# EAGLE design CompactDomeSensorRing (EAGLE 9.7.0)
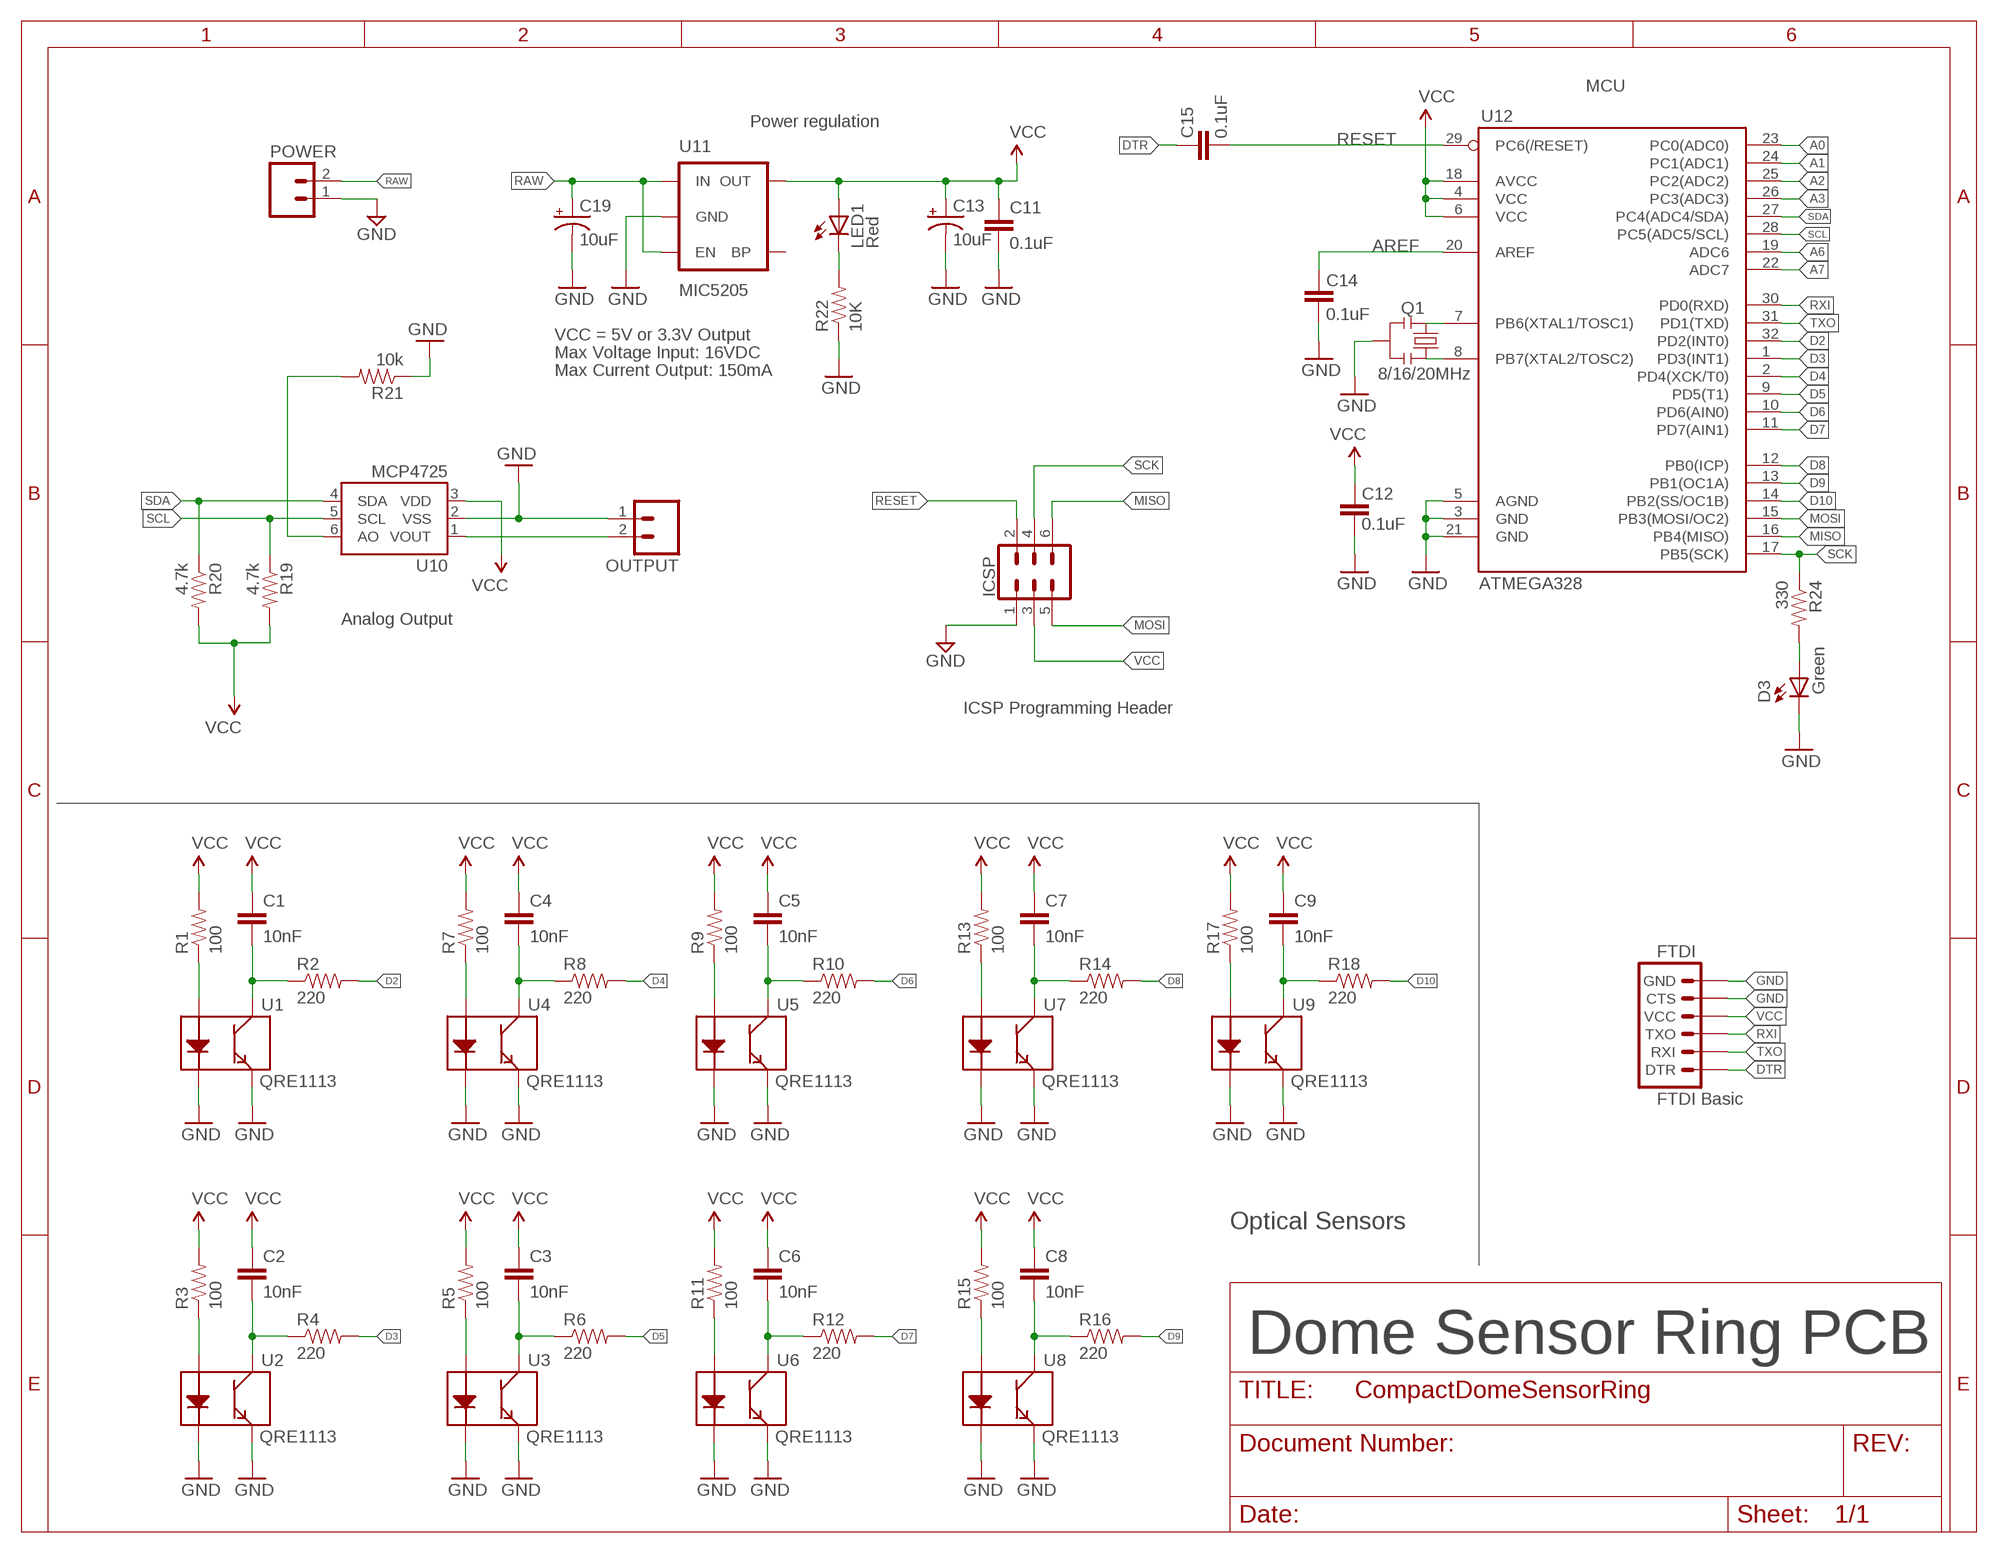
[diagram p0: schematic, sheet 1]

## Parts
C1  10nF  CAP0402-CAP  [0402-CAP]
C2  10nF  CAP0402-CAP  [0402-CAP]
C3  10nF  CAP0402-CAP  [0402-CAP]
C4  10nF  CAP0402-CAP  [0402-CAP]
C5  10nF  CAP0402-CAP  [0402-CAP]
C6  10nF  CAP0402-CAP  [0402-CAP]
C7  10nF  CAP0402-CAP  [0402-CAP]
C8  10nF  CAP0402-CAP  [0402-CAP]
C9  10nF  CAP0402-CAP  [0402-CAP]
C11  0.1uF  CAP0603-CAP  [0603-CAP]
C12  0.1uF  CAP0603-CAP  [0603-CAP]
C13  10uF  CAP_POL1206  [EIA3216]
C14  0.1uF  CAP0603-CAP  [0603-CAP]
C15  0.1uF  CAP0603-CAP  [0603-CAP]
C19  10uF  CAP_POL1206  [EIA3216]
D3  Green  LED  [0603-LED-ALT1]
FTDI  FTDI Basic  ARDUINO_SERIAL_PROGRAMPTH  [1X06]
ICSP  CONN_03X2NO_SILK  [2X3-NS]
LED1  Red  LED  [0603-LED-ALT1]
OUTPUT  M02PTH  [1X02]
POWER  M02PTH  [1X02]
Q1  8/16/20MHz  RESONATOR1:1  [RESONATOR-SMD-1:1]
R1  100  RESISTOR0402-RES  [0402-RES]
R2  220  RESISTOR0402-RES  [0402-RES]
R3  100  RESISTOR0402-RES  [0402-RES]
R4  220  RESISTOR0402-RES  [0402-RES]
R5  100  RESISTOR0402-RES  [0402-RES]
R6  220  RESISTOR0402-RES  [0402-RES]
R7  100  RESISTOR0402-RES  [0402-RES]
R8  220  RESISTOR0402-RES  [0402-RES]
R9  100  RESISTOR0402-RES  [0402-RES]
R10  220  RESISTOR0402-RES  [0402-RES]
R11  100  RESISTOR0402-RES  [0402-RES]
R12  220  RESISTOR0402-RES  [0402-RES]
R13  100  RESISTOR0402-RES  [0402-RES]
R14  220  RESISTOR0402-RES  [0402-RES]
R15  100  RESISTOR0402-RES  [0402-RES]
R16  220  RESISTOR0402-RES  [0402-RES]
R17  100  RESISTOR0402-RES  [0402-RES]
R18  220  RESISTOR0402-RES  [0402-RES]
R19  4.7k  RESISTOR0603-RES  [0603-RES]
R20  4.7k  RESISTOR0603-RES  [0603-RES]
R21  10k  RESISTOR0603-RES  [0603-RES]
R22  10K  RESISTOR0603-RES  [0603-RES]
R24  330  RESISTOR0603-RES  [0603-RES]
U1  QRE1113  [QRE1113]
U2  QRE1113  [QRE1113]
U3  QRE1113  [QRE1113]
U4  QRE1113  [QRE1113]
U5  QRE1113  [QRE1113]
U6  QRE1113  [QRE1113]
U7  QRE1113  [QRE1113]
U8  QRE1113  [QRE1113]
U9  QRE1113  [QRE1113]
U10  MCP4725  MCP4725SOT-23  [SOT23-6]
U11  MIC5205  V_REG_LDOSMD  [SOT23-5]
U12  ATMEGA328  ATMEGA168  [TQFP32-08]

## Nets
A0: U12.23(PC0(ADC0))
A1: U12.24(PC1(ADC1))
A2: U12.25(PC2(ADC2))
A3: U12.26(PC3(ADC3))
A6: U12.19(ADC6)
A7: U12.22(ADC7)
AREF: C14.2 U12.20(AREF)
D2: R2.2 U12.32(PD2(INT0))
D3: R4.2 U12.1(PD3(INT1))
D4: R8.2 U12.2(PD4(XCK/T0))
D5: R6.2 U12.9(PD5(T1))
D6: R10.2 U12.10(PD6(AIN0))
D7: R12.2 U12.11(PD7(AIN1))
D8: R14.2 U12.12(PB0(ICP))
D9: R16.2 U12.13(PB1(OC1A))
D10: R18.2 U12.14(PB2(SS/OC1B))
DTR: C15.2 FTDI.1(DTR)
GND [power]: C11.2 C12.1 C13.C(-) C14.1 C19.C(-) D3.C FTDI.5(CTS) FTDI.6(GND) ICSP.1 OUTPUT.1 POWER.1 Q1.2 R21.1 R22.1 U1.2(K) U1.4(E) U2.2(K) U2.4(E) U3.2(K) U3.4(E) U4.2(K) U4.4(E) U5.2(K) U5.4(E) U6.2(K) U6.4(E) U7.2(K) U7.4(E) U8.2(K) U8.4(E) U9.2(K) U9.4(E) U10.2(VSS) U11.2(GND) U12.3(GND) U12.5(AGND) U12.21(GND)
MISO: ICSP.6 U12.16(PB4(MISO))
MOSI: ICSP.5 U12.15(PB3(MOSI/OC2))
N$1: R1.1 U1.1(A)
N$2: R3.1 U2.1(A)
N$3: R5.1 U3.1(A)
N$4: R7.1 U4.1(A)
N$5: R9.1 U5.1(A)
N$6: R11.1 U6.1(A)
N$7: R13.1 U7.1(A)
N$8: R15.1 U8.1(A)
N$9: R17.1 U9.1(A)
N$12: R21.2 U10.6(AO)
N$14: D3.A R24.2
N$15: Q1.3 U12.8(PB7(XTAL2/TOSC2))
N$16: Q1.1 U12.7(PB6(XTAL1/TOSC1))
N$18: LED1.C R22.2
OUT1: C1.2 R2.1 U1.3(C)
OUT2: C2.2 R4.1 U2.3(C)
OUT3: C3.2 R6.1 U3.3(C)
OUT4: C4.2 R8.1 U4.3(C)
OUT5: C5.2 R10.1 U5.3(C)
OUT6: C6.2 R12.1 U6.3(C)
OUT7: C7.2 R14.1 U7.3(C)
OUT8: C8.2 R16.1 U8.3(C)
OUT9: C9.2 R18.1 U9.3(C)
RAW [power]: C19.A(+) POWER.2 U11.1(IN) U11.3(EN)
RESET: C15.1 ICSP.2 U12.29(PC6(/RESET))
RXI: FTDI.3(TXO) U12.30(PD0(RXD))
SCK: ICSP.4 R24.1 U12.17(PB5(SCK))
SCL: R19.1 U10.5(SCL) U12.28(PC5(ADC5/SCL))
SDA: R20.1 U10.4(SDA) U12.27(PC4(ADC4/SDA))
TXO: FTDI.2(RXI) U12.31(PD1(TXD))
VCC [power]: C1.1 C2.1 C3.1 C4.1 C5.1 C6.1 C7.1 C8.1 C9.1 C11.1 C12.2 C13.A(+) FTDI.4(VCC) ICSP.3 LED1.A R1.2 R3.2 R5.2 R7.2 R9.2 R11.2 R13.2 R15.2 R17.2 R19.2 R20.2 U10.3(VDD) U11.5(OUT) U12.4(VCC) U12.6(VCC) U12.18(AVCC)
VOUT: OUTPUT.2 U10.1(VOUT)
Unconnected: U11.4(BP)

## Notes on the sheet
- MCU
- Power regulation
- VCC = 5V or 3.3V Output
- Max Voltage Input: 16VDC
- Max Current Output: 150mA
- Analog Output
- ICSP Programming Header
- Optical Sensors
- Dome Sensor Ring PCB

## Library data of the parts
C1-C9 C11 C12 C14 C15 = SparkFun:CAP: Capacitor Standard 0603 ceramic capacitor, and 0.1" leaded capacitor.
C13 C19 = SparkFun:CAP_POL: Capacitor Polarized These are standard SMD and PTH capacitors. Normally 10uF, 47uF, and 100uF in electrolytic and tantalum varieties. Always verify the external diameter of the through hole cap, it varies with capacity, voltage, and manufacturer. The EIA devices should be standard.
D3 LED1 = Testing:LED: LEDs Standard schematic elements and footprints for 5mm, 3mm, 1206, and 0603 sized LEDs. 5mm - Spark Fun Electronics SKU : COM-00529 (and others)
FTDI = SparkFun:ARDUINO_SERIAL_PROGRAM
ICSP = SparkFun-Connectors:CONN_03X2: Multi connection point. Often used as Generic Header-pin footprint for 0.1 inch spaced/style header connections You can populate with any combo of single row headers, but if you'd like an exact match, check these: Header - 2x3 (Male, 0.1") <https://www.sparkfun.com/products/12807> (PRT-12807) Header - 2x3 (Female, 0.1") <https://www.sparkfun.com/products/13010> (PRT-13010) 2x3 Pin Shrouded Header <https://www.sparkfun.com/products/10877> (PRT-10877) On any of the 0.1 inch spaced packages, you can populate with these: Break Away Headers - Straight <https://www.sparkfun.com/products/116> (PRT-00116) Break Away Male Headers - Right Angle <https://www.sparkfun.com/products/553> (PRT-00553) Female Headers <https://www.sparkfun.com/products/115> (PRT-00115) Break Away Headers - Machine Pin <https://www.sparkfun.com/products/117> (PRT-00117) Break Away Female Headers - Swiss Machine Pin <https://www.sparkfun.com/products/743> (PRT-00743) Special note: the shrouded connector mates well with our 3x2 ribbon cables: Ribbon Crimp Connector - 6-pin (2x3, Female) <https://www.sparkfun.com/products/10651> (PRT-10651) Ribbon Cable - 6 wire (15ft) <https://www.sparkfun.com/products/10646> (PRT-10646)
OUTPUT POWER = SparkFun-Connectors:M02: Standard 2-pin 0.1" header. Use with - straight break away headers ( PRT-00116) - right angle break away headers (PRT-00553) - swiss pins (PRT-00743) - machine pins (PRT-00117) - female headers (PRT-00115) Molex polarized connector foot print use with: PRT-08233 with associated crimp pins and housings. 2.54_SCREWTERM for use with PRT-10571. 3.5mm Screw Terminal footprints for PRT-08084 5mm Screw Terminal footprints for use with PRT-08432
Q1 = Testing:RESONATOR: Resonator Small SMD resonator. This is the itty bitty 10/20MHz resonators with built in caps. CSTCE10M0G55 and CSTCE20M0V53. Footprint for SMD has been used in SFE production for years, and does work okay. 1:1 is an attempt to get larger fillets on the sides so it will be easier to inspect these solders in our AOI machine. The pads have been minimized to match the actual metal under the resonator. To see this relation, it includes an image import of the bottom side of the component. Imported to scale on layer 200.
R1-R22 R24 = SparkFun:RESISTOR: Resistor Basic schematic elements and footprints for 0603, 1206, and PTH resistors.
U1-U9 = SparkFun:QRE1113
U10 = SparkFun-AnalogIC:MCP4725: Microchip 12-bit I2C DAC, SOT23-6; PROD_ID: IC-08886
U11 = SparkFun:V_REG_LDO: Voltage Regulator LDO Standard 150mA LDO voltage regulator in SOT-23 layout. Micrel part MIC5205. BP (by-pass) pin is used to lower output noise with 470pF cap.
U12 = SparkFun:ATMEGA168

## Net classes
0 default: width 0.203 mm
1 power: width 0.254 mm

## Board
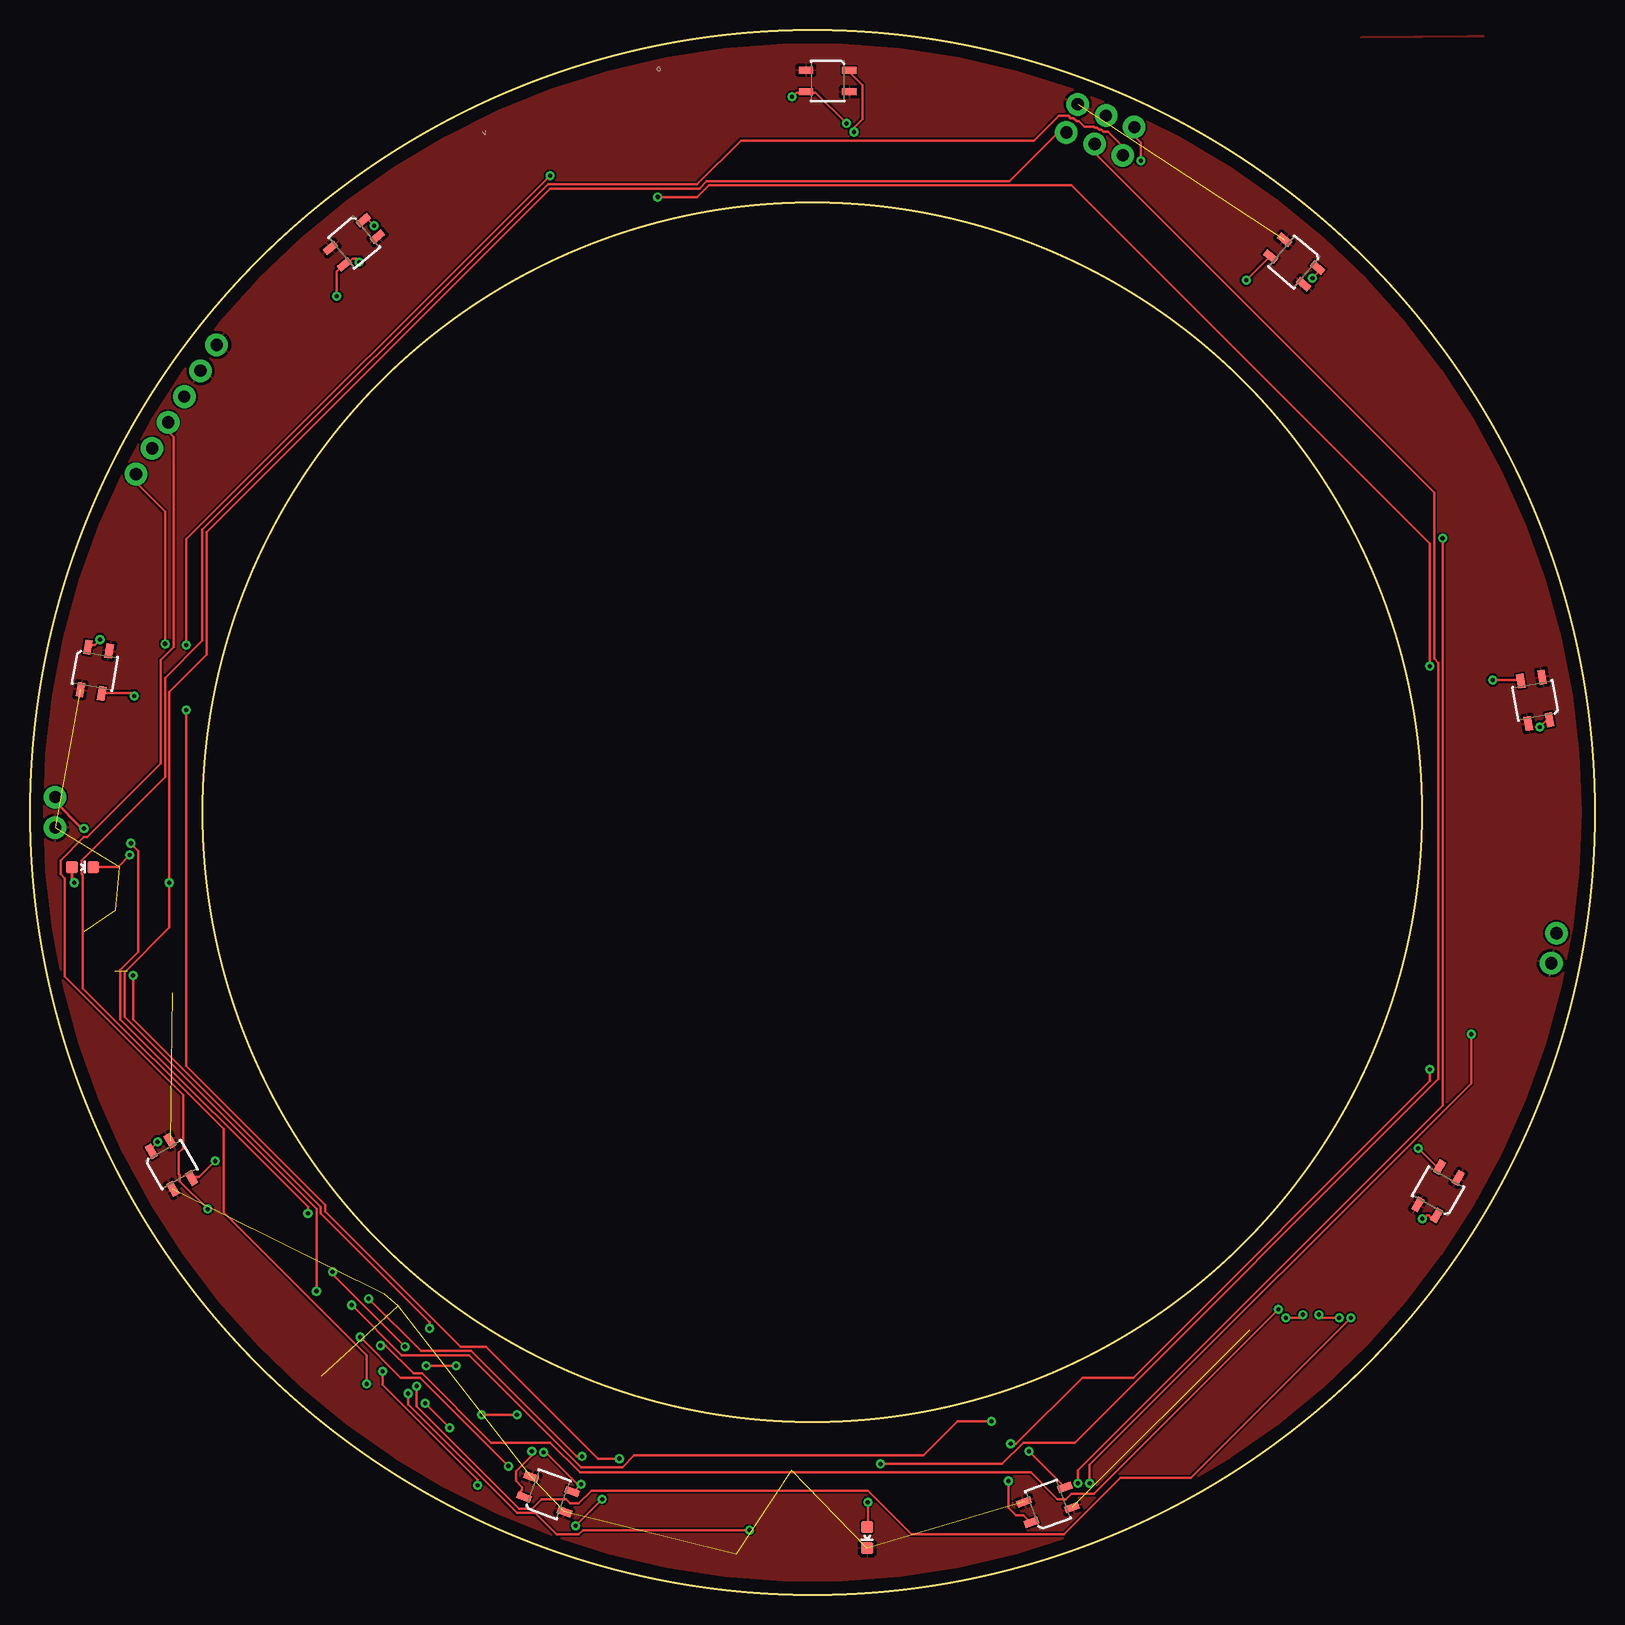
[diagram p1: board, top side]
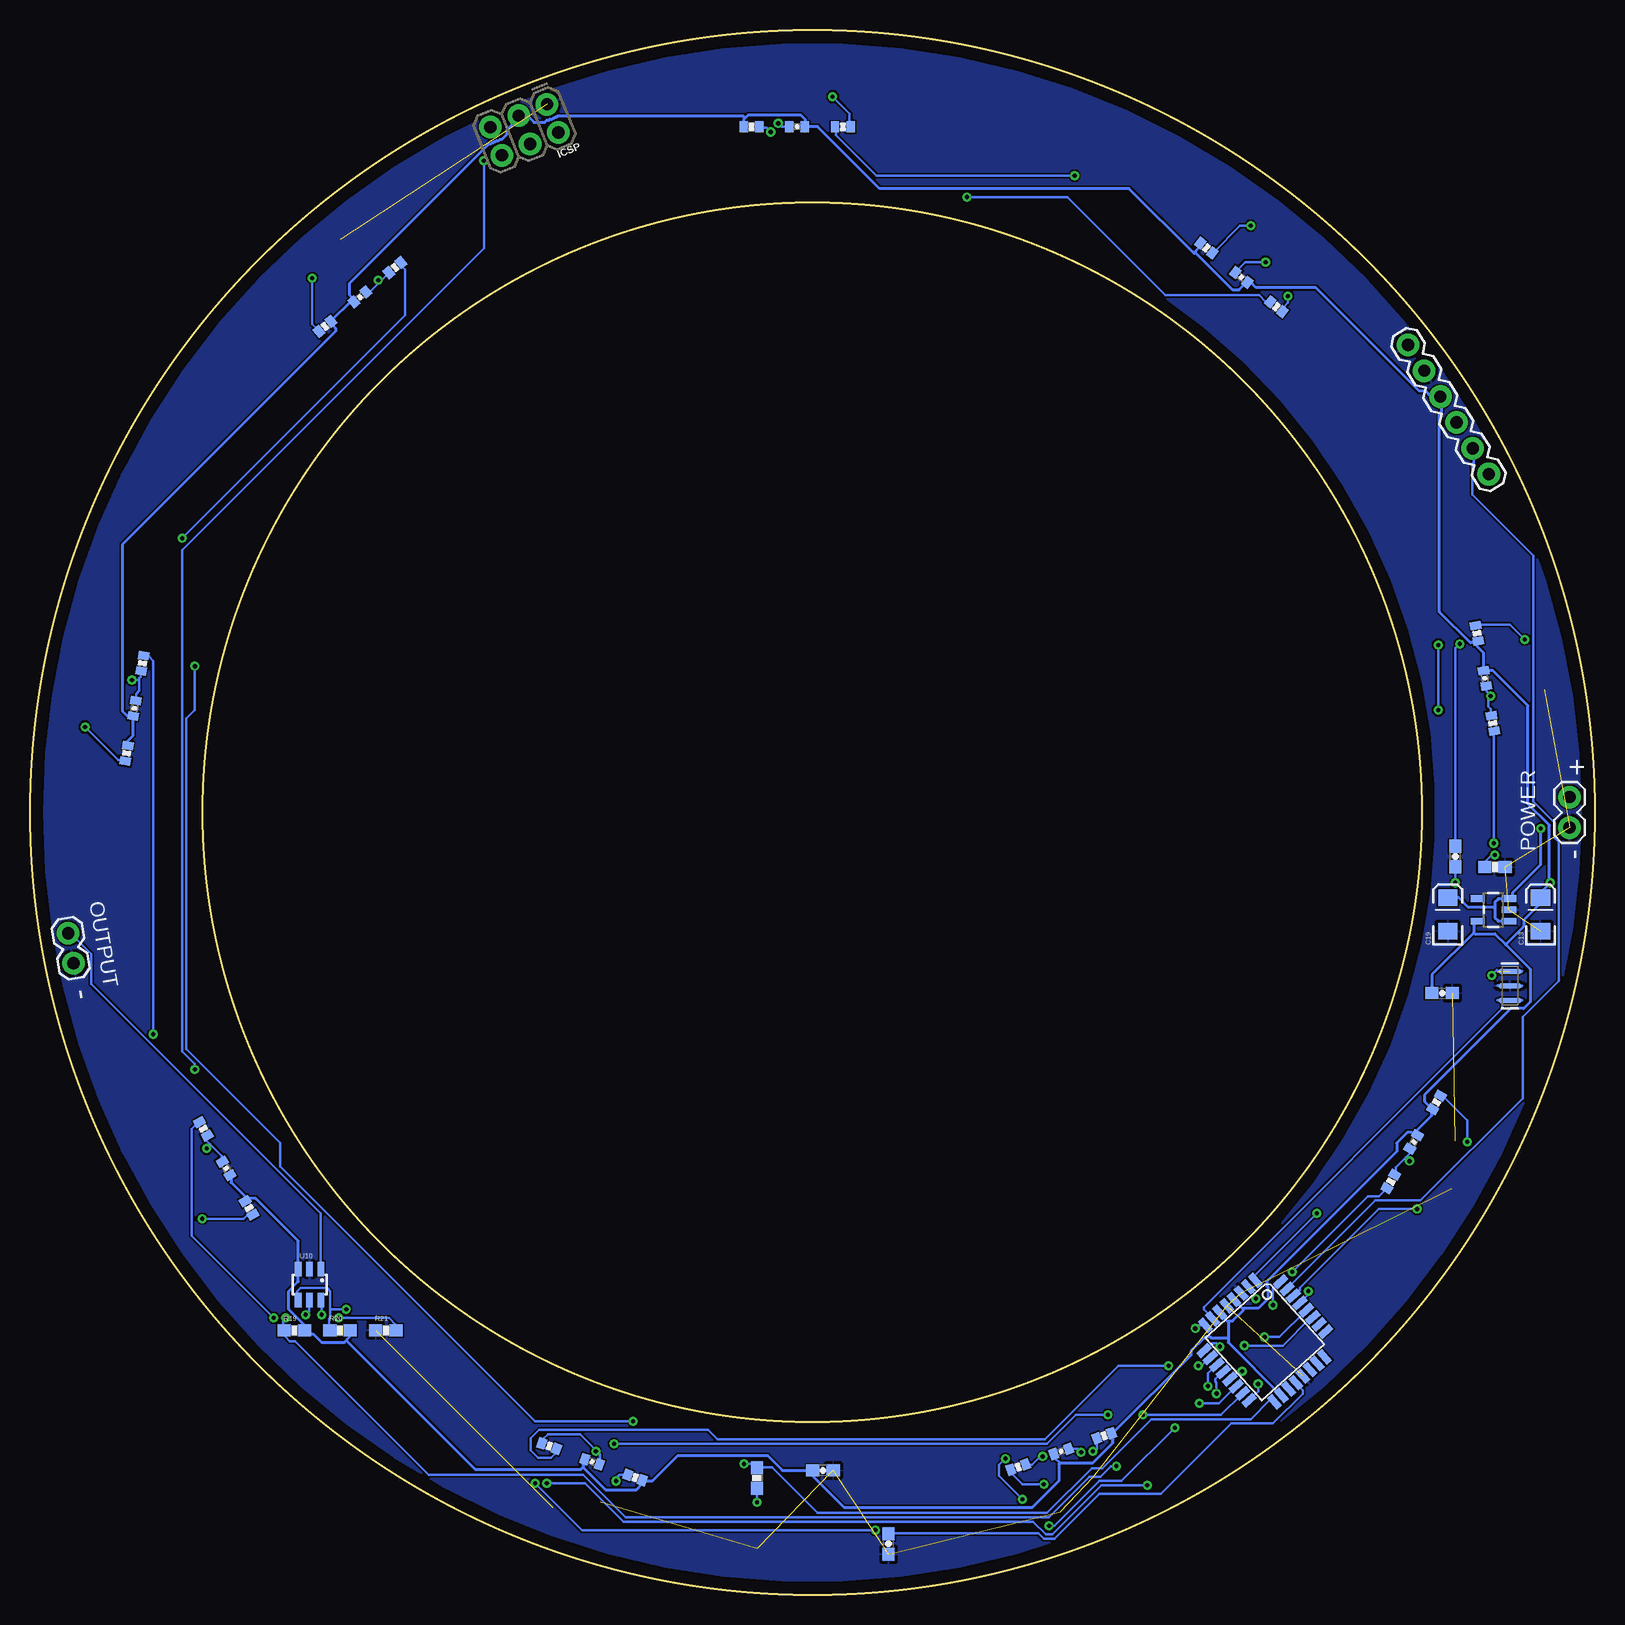
[diagram p2: board, bottom side, seen from below]

Size 130.43 x 130.43 mm. Coordinates in mm from the lower left corner, seen from the top.
Outline: circle at 65.22,65.22 radius 65.22
Outline: circle at 65.22,65.22 radius 50.82
Copper layers (1*16): Top 0.035mm / dielectric 1.5mm / Bottom 0.035mm
Design rules "default": minimum track width 6mil, minimum drill 0.35mm, track to track 6mil, track to pad 6mil, pad to pad 6mil, via to via 6mil, smd to smd 6mil, copper to edge 40mil, drill to drill 6mil, minimum pad ring 10mil, minimum via ring 8mil, stop-mask expansion 4mil, vias tented up to drill 0mil, thermal gap 10mil

### Footprints (pad centres in the part's own frame; a part is rotated, then mirrored left to right if it is on the bottom)
0402-CAP = smd 0.7 x 0.9: 1 -0.65,0; 2 0.65,0
0603-CAP = smd 1.1 x 1: 1 -0.85,0; 2 0.85,0
EIA3216 = smd 1.4 x 1.6: A 1.4,0; C -1.4,0
0603-LED-ALT1 = smd 1 x 1: A 0,-0.877; C 0,0.877
1X06 = drill 1.016 pad 1.88: 1 0,0; 2 2.54,0; 3 5.08,0; 4 7.62,0; 5 10.16,0; 6 12.7,0
2X3-NS = drill 1.016 pad 1.88: 1 -2.54,-1.27; 2 -2.54,1.27; 3 0,-1.27; 4 0,1.27; 5 2.54,-1.27; 6 2.54,1.27
1X02 = drill 1.016 pad 1.88: 1 0,0; 2 2.54,0
RESONATOR-SMD-1:1 = smd 0.45 x 1.905: 1 -1.2,0; 2 0,0; 3 1.2,0
0402-RES = smd 0.7 x 0.9: 1 -0.65,0; 2 0.65,0
0603-RES = smd 1.1 x 1: 1 -0.85,0; 2 0.85,0
QRE1113 = smd 1.2 x 0.6: 1 -1.8,-0.9; 2 1.8,-0.9; 3 1.8,0.9; 4 -1.8,0.9
SOT23-6 = smd 0.55 x 1.2: 1 0.95,1.3; 2 0,1.3; 3 -0.95,1.3; 4 -0.95,-1.3; 5 0,-1.3; 6 0.95,-1.3
SOT23-5 = smd 0.55 x 1.2: 1 -0.95,-1.3; 2 0,-1.3; 3 0.95,-1.3; 4 0.95,1.3; 5 -0.95,1.3
TQFP32-08 = smd 1.27 x 0.559: 1 -4.293,2.8; 2 -4.293,2; 3 -4.293,1.2; 4 -4.293,0.4; 5 -4.293,-0.4; 6 -4.293,-1.2; 7 -4.293,-2; 8 -4.293,-2.8; 17 4.293,-2.8; 18 4.293,-2; 19 4.293,-1.2; 20 4.293,-0.4; 21 4.293,0.4; 22 4.293,1.2; 23 4.293,2; 24 4.293,2.8 | smd 0.559 x 1.27: 9 -2.8,-4.293; 10 -2,-4.293; 11 -1.2,-4.293; 12 -0.4,-4.293; 13 0.4,-4.293; 14 1.2,-4.293; 15 2,-4.293; 16 2.8,-4.293; 25 2.8,4.293; 26 2,4.293; 27 1.2,4.293; 28 0.4,4.293; 29 -0.4,4.293; 30 -1.2,4.293; 31 -2,4.293; 32 -2.8,4.293

### Placement (x,y rotation side)
C1  29.45,109.81 141 bottom
C2  9.16,76.39 280 bottom
C3  15.09,37.74 240 bottom
C4  44.48,11.95 20 bottom
C5  83.57,11.08 340 bottom
C6  114.08,35.54 120 bottom
C7  121.72,73.89 80 bottom
C8  102.92,108.18 40 bottom
C9  66.49,122.37 180 bottom
C11  12.72,50.14 0 bottom
C12  64.33,10.35 180 bottom
C13  4.51,56.71 90 bottom
C14  58.87,4.23 90 bottom
C15  11.62,61.53 90 bottom
C19  12.26,56.71 90 bottom
D3  69.79,4.76 180 top
FTDI  8.83,93.41 122 bottom
ICSP  89.22,122.11 202 bottom
LED1  4.39,60.64 270 top
OUTPUT  126.81,52.64 100 bottom
POWER  2.1,63.95 90 bottom
Q1  7.07,50.76 90 bottom
R1  32.37,112.26 141 bottom
R2  26.54,107.36 141 bottom
R3  9.82,80.14 280 bottom
R4  8.49,72.64 280 bottom
R5  13.18,41.04 240 bottom
R6  16.99,34.44 240 bottom
R7  40.9,13.25 20 bottom
R8  48.06,10.64 20 bottom
R9  79.99,9.78 340 bottom
R10  87.15,12.38 340 bottom
R11  112.17,32.24 120 bottom
R12  115.98,38.84 120 bottom
R13  122.38,70.14 80 bottom
R14  121.06,77.64 80 bottom
R15  105.84,105.73 40 bottom
R16  100.01,110.63 40 bottom
R17  70.3,122.37 180 bottom
R18  62.68,122.37 180 bottom
R19  108.4,22.04 0 bottom
R20  104.59,22.04 0 bottom
R21  100.78,22.04 0 bottom
R22  8.32,60.64 180 bottom
R24  69.82,9.72 270 bottom
U1  27.01,112.73 220 top
U2  5.4,77.05 260 top
U3  11.79,35.84 300 top
U4  43.17,8.37 340 top
U5  84.87,7.5 20 top
U6  117.37,33.64 60 top
U7  125.47,74.55 100 top
U8  105.37,111.1 140 top
U9  66.49,126.18 180 top
U10  107.13,25.85 0 bottom
U11  8.45,57.09 90 bottom
U12  27.5,21.15 312 bottom

### Tracks (layer width: path | path; a pad name or v marks a point on that pad's centre or on a via)
AREF
  Bottom 0.203: C14.2 58.82,5.12 46.37,5.12 45.93,4.68 45.04,4.68 41.3,8.41 36.15,8.41 30.28,14.28 26.81,14.28 24.32,16.77 24.32,17.03 24.94,17.65 U12.20
D2  (via drill 0.35)
  Top 0.203: v52.33,116.51 55.62,116.51 56.59,117.49 86.82,117.49 116.69,87.62 v116.69,77.4 | v80.15,14.45 77.31,14.45 74.46,11.61 50.37,11.61 49.39,10.63 45.93,10.63 36.59,19.97 30.99,19.97 v26.81,24.14
  Bottom 0.203: v52.33,116.51 43.97,116.51 35.79,108.33 27.97,108.33 27.43,107.8 27.08,107.8 R2.2 | v116.69,77.4 116.69,73.75 117.4,73.04 117.4,45.48 109.58,37.66 109.58,35.7 88.33,14.45 v80.15,14.45 | v26.81,24.14 26.81,25.48 26.19,26.1 U12.32
D3  (via drill 0.35)
  Top 0.203: v8.41,62.64 9.03,62.02 9.03,53.57 7.52,52.06 7.52,47.97 23.17,32.32 v23.17,31.79
  Bottom 0.203: v8.41,62.64 8.41,71.97 R4.2 | v23.17,31.79 28.41,26.54 28.41,26.37 28.32,26.28 U12.1
D4  (via drill 0.35)
  Top 0.203: v46.01,11.52 45.57,11.52 36.77,20.32 32.59,20.32 v28.23,24.68
  Bottom 0.203: v46.01,11.52 46.19,11.52 46.9,10.81 47.44,10.81 R8.2 | v28.23,24.68 28.23,24.94 28.95,25.66 U12.2
D5  (via drill 0.35)
  Top 0.203: v25.21,26.9 25.21,26.72 v31.26,20.68
  Bottom 0.203: v25.21,26.9 18.9,33.21 18.01,33.21 17.39,33.83 R6.2 | v31.26,20.68 31.52,20.94 31.88,20.94 32.5,20.32 U12.9
D6  (via drill 0.35)
  Top 0.203: v33.03,19.08 v35.52,19.08
  Bottom 0.203: v35.52,19.08 39.7,19.08 45.84,12.94 73.13,12.94 73.93,13.74 87.97,13.74 88.69,13.03 88.69,12.05 88.06,11.43 87,11.43 86.55,11.88 86.55,12.14 R10.2 | v33.03,19.08 32.77,19.08 32.06,19.79 U12.10
D7  (via drill 0.35)
  Top 0.203: v110.11,23.08 96.78,9.74 90.91,9.74 86.2,5.03 73.48,5.03 69.84,8.68 46.81,8.68 45.75,7.61 45.04,7.61 44.68,7.96 42.64,7.96 41.84,7.16 40.77,7.16 32.23,15.7 v32.23,17.39
  Bottom 0.203: v110.11,23.08 116.96,29.92 116.96,38.81 116.69,39.08 116.6,39.08 116.33,39.35 R12.2 | v32.23,17.39 32.23,18.46 31.52,19.17 U12.11
D8  (via drill 0.35)
  Top 0.203: v120.16,46.73 120.16,42.64 88.33,10.81 v88.33,9.3 | v59.97,5.39 46.1,5.39 45.75,5.03 43.88,5.03 42.1,6.81 40.59,6.81 31.52,15.88 v31.52,16.77
  Bottom 0.203: v120.16,46.73 120.16,77.84 120.51,78.2 120.87,78.2 R14.2 | v88.33,9.3 84.42,5.39 v59.97,5.39 | v31.52,16.77 31.52,17.65 31.61,17.74 31.61,18.01 30.99,18.63 U12.12
D9  (via drill 0.35)
  Top 0.203: v117.76,88.06 117.76,40.77 87.35,10.37 v87.35,9.3 | v37.3,9.12 37.3,9.57 29.39,17.48 v29.39,18.63
  Bottom 0.203: v117.76,88.06 99.18,106.64 99.18,110.47 99.44,110.73 99.44,111 R16.2 | v87.35,9.3 84.15,9.3 80.95,6.1 46.81,6.1 45.75,5.03 45.21,5.03 41.12,9.12 v37.3,9.12 | v29.39,18.63 29.66,18.63 30.37,17.92 U12.13
D10  (via drill 0.35)
  Top 0.203: v43.35,118.29 13.03,87.97 v13.03,79.17 | v13.03,73.75 13.03,44.06 24.59,32.5 24.59,31.97 35.88,20.68 38.01,20.68 47.35,11.34 v49.13,11.34 | v45.48,5.74 v47.7,7.96 | v32.95,15.97 v34.99,13.92
  Bottom 0.203: v43.35,118.29 59.88,118.29 63.26,121.67 63.26,122.29 R18.2 | v13.03,73.75 v13.03,79.17 | v49.13,11.34 49.66,10.81 49.66,9.92 v47.7,7.96 | v45.48,5.74 45.04,5.74 41.3,9.48 39.44,9.48 v34.99,13.92 | v32.95,15.97 31.35,15.97 29.92,17.39 U12.14
DTR  (via drill 0.35)
  Top 0.203: v11.25,79.26 11.25,90.29 8.85,92.69 8.85,93.4 FTDI.1
  Bottom 0.203: v11.25,79.26 11.61,78.91 11.61,62.46 C15.2
GND  (16 unrouted)
  pour Top: -0.82,133.8 129.99,133.8 129.99,2.99 135.07,-2.09 2.99,-2.09 0.45,0.45
  pour Bottom: -2.09,131.26 136.34,131.26 136.34,1.72 138.88,-0.82 5.53,-0.82 0.45,-5.9
MISO  (via drill 0.35)
  Top 0.203: v28.06,17.57 28.06,19.97 16.14,31.88 16.14,38.81 4.41,50.55 4.41,59.97 4.32,60.06 4.32,61.22 11.25,68.15 11.25,76.42 14.37,79.53 14.37,88.77 43.17,117.58 55.62,117.58 59.26,121.22 83.71,121.22 85.75,123.27 86.55,123.27 86.73,123.09 87,123.09 87.26,122.82 87.44,122.82 87.89,122.38 88.69,122.38 88.77,122.29 88.95,122.29 89.13,122.11 89.31,122.11 89.49,121.93 89.84,121.93 91.09,120.69 91.09,120.07 ICSP.6
  Bottom 0.203: v28.06,17.57 28.06,16.94 28.77,16.23 U12.16
MOSI  (via drill 0.35)
  Top 0.203: v40.59,14.99 v37.66,14.99 | v81.75,12.59 82.2,12.59 87.71,18.1 91.98,18.1 116.69,42.81 v116.69,43.79 | v92.6,119.53 92.6,121.05 92.06,121.58 92.06,122.29 ICSP.5
  Bottom 0.203: v37.66,14.99 31.17,14.99 29.39,16.77 U12.15 | v40.59,14.99 43.26,14.99 45.66,12.59 v81.75,12.59 | v116.69,43.79 116.69,44.24 117.76,45.3 117.76,87.09 92.6,112.24 v92.6,119.53
N$1  (via drill 0.35)
  Top 0.203: v28.68,114.11 28.15,114.64 27.88,114.64 U1.1
  Bottom 0.203: v28.68,114.11 29.57,114.11 31.79,111.89 R1.1
N$2  (via drill 0.35)
  Top 0.203: v5.83,79.62 5.39,79.17 5.03,79.17 4.85,79 U2.1
  Bottom 0.203: v5.83,79.62 7.08,80.86 9.92,80.86 R3.1
N$3  (via drill 0.35)
  Top 0.203: v10.63,37.75 10.1,37.21 U3.1
  Bottom 0.203: v10.63,37.75 10.63,39.52 12.68,41.57 12.85,41.57 R5.1
N$4  (via drill 0.35)
  Top 0.203: v41.84,11.97 41.84,11.61 40.5,10.28 40.5,9.48 41.04,8.94 41.04,8.76 40.95,8.68 40.95,8.32 41.12,8.14 U4.1
  Bottom 0.203: v41.84,11.97 41.66,11.97 41.48,12.14 41.48,12.94 R7.1
N$5  (via drill 0.35)
  Top 0.203: v81.57,9.48 81.57,7.25 82.2,6.63 82.82,6.63 83.44,6.01 U5.1
  Bottom 0.203: v81.57,9.48 81.57,9.74 81.31,10.01 80.69,10.01 R9.1
N$6  (via drill 0.35)
  Top 0.203: v116.07,31.35 116.16,31.35 116.42,31.61 116.6,31.61 116.87,31.35 116.96,31.35 117.22,31.61 U6.1
  Bottom 0.203: v116.07,31.35 112.6,31.35 112.33,31.61 111.89,31.61 R11.1
N$7  (via drill 0.35)
  Top 0.203: v125.85,72.33 126.47,72.95 126.65,72.95 U7.1
  Bottom 0.203: v125.85,72.33 123.09,69.57 122.56,69.57 R13.1
N$8  (via drill 0.35)
  Top 0.203: v106.91,109.76 107.44,110.29 107.44,110.47 107.36,110.56 U8.1
  Bottom 0.203: v106.91,109.76 106.91,105.93 106.38,105.4 R15.1
N$9  (via drill 0.35)
  Top 0.203: v68.68,121.93 68.68,122.29 69.39,123 69.39,125.85 68.24,127 U9.1
  Bottom 0.203: v68.68,121.93 69.04,122.29 69.57,122.29 R17.1
N$12  (via drill 0.35)
  Top 0.203: v104.69,23.08 105.84,23.08 v106.11,23.34
  Bottom 0.203: v104.69,23.08 100.51,23.08 99.98,22.54 99.98,22.1 R21.2 | v106.11,23.34 106.11,24.5 U10.6
N$14  (via drill 0.35)
  Top 0.203: v69.84,7.7 69.84,5.65 D3.A
  Bottom 0.203: v69.84,7.7 69.84,8.85 R24.2
N$15  (via drill 0.35)  (1 unrouted)
  Top 0.203: v33.3,22.19 33.3,22.72 24.23,31.79 24.23,32.32 8.59,47.97 v8.59,51.61
  Bottom 0.203: v33.3,22.19 33.03,22.46 32.5,22.46 U12.8 | v8.59,51.61 8.14,52.06 8.09,51.95
N$16
  Bottom 0.203: U12.7 31.88,23.08 32.59,23.79 32.59,23.97 7.7,48.86 7.7,49.48 Q1.1
N$18  (via drill 0.35)
  Top 0.203: v8.32,61.66 7.34,60.68 5.3,60.68 LED1.C
  Bottom 0.203: v8.32,61.66 8.59,61.66 9.12,61.13 9.12,60.68 R22.2
OUT1  (via drill 0.35)
  Top 0.203: v25.57,108.24 25.57,110.29 26.19,110.91 U1.3 26.28,110.91 26.46,110.91 26.9,111.36 27.17,111.36 v27.43,111.09
  Bottom 0.203: v25.57,108.24 25.57,107.71 26.01,107.27 26.01,107 R2.1 | v27.43,111.09 29.12,111.09 29.92,110.29 C1.2
OUT2  (via drill 0.35)
  Top 0.203: v8.68,74.91 8.41,75.17 6.01,75.17 U2.3
  Bottom 0.203: 8.85,74.91 8.85,75.17 9.12,75.44 9.12,75.71 C2.2 | 8.85,74.91 8.85,74.02 8.68,73.84 8.68,73.31 R4.1 | v8.68,74.91 8.85,74.91
OUT3  (via drill 0.35)
  Top 0.203: v15.43,36.15 14.1,34.81 13.48,34.81 U3.3
  Bottom 0.203: 15.74,36.46 15.34,36.86 15.34,37.12 C3.2 | 15.74,36.46 16.59,35.61 16.59,35.08 R6.1 | 15.74,36.46 v15.43,36.15
OUT4  (via drill 0.35)
  Top 0.203: U4.3 45.21,8.68 45.39,8.68 v45.93,9.21 45.75,9.12 42.99,11.88 v42.81,11.88
  Bottom 0.203: v45.93,9.21 47.7,9.21 48.59,10.1 48.59,10.37 R8.1 | v42.81,11.88 43.08,12.14 43.79,12.14 C4.2
OUT5  (via drill 0.35)
  Top 0.203: v83.26,11.97 86.2,9.03 U5.3
  Bottom 0.203: 83.22,12.01 84.6,13.39 87.26,13.39 87.71,12.94 87.71,12.68 R10.1 | 83.22,12.01 82.91,11.7 82.91,10.9 C5.2 | v83.26,11.97 83.22,12.01
OUT6  (via drill 0.35)
  Top 0.203: v115.71,37.21 117.22,35.7 117.49,35.7 U6.3
  Bottom 0.203: 115.4,37.52 115.8,37.92 115.8,38.1 115.71,38.19 R12.1 | 115.4,37.52 114.47,36.59 114.47,36.15 C6.2 | 115.4,37.52 v115.71,37.21
OUT7  (via drill 0.35)
  Top 0.203: v121.93,76.24 124.25,76.24 U7.3
  Bottom 0.203: 121.31,76.24 121.31,76.42 121.22,76.51 121.22,76.95 R14.1 | 121.31,76.24 121.31,75.35 121.58,75.08 121.58,74.55 C7.2 | 121.31,76.24 v121.93,76.24
OUT8  (via drill 0.35)
  Top 0.203: v101.4,109.58 103.35,111.53 U8.3
  Bottom 0.203: 101.27,109.44 102.11,108.6 102.38,108.6 C8.2 | 101.27,109.44 R16.1 | 101.27,109.44 v101.4,109.58
OUT9  (via drill 0.35)
  Top 0.203: v63.53,124.87 63.88,125.22 64.68,125.22 U9.3 64.77,125.22 65.48,125.22 v68.06,122.65
  Bottom 0.203: v63.53,124.87 62.11,123.45 62.11,122.38 R18.1 | v68.06,122.65 67.79,122.38 67.17,122.38 C9.2
RAW  (via drill 0.35)
  Top 0.254: POWER.2 2.1,66.11 4.32,63.88 v4.5,63.88
  Bottom 0.254: 8.32,57.3 8.32,57.75 8.05,58.02 7.16,58.02 U11.3 7.08,57.93 6.81,58.19 6.81,58.55 4.5,60.86 v4.5,63.88 | 8.32,57.3 8.32,56.42 8.05,56.15 7.16,56.15 U11.1 | 8.32,57.3 10.54,57.3 11.34,58.1 12.23,58.1 C19.A
RESET  (via drill 0.35)
  Top 0.203: v23.88,25.3 23.88,32.15 7.88,48.15 7.88,51.88 11.61,55.62 v11.61,59.35 11.61,75.26 14.72,78.37 14.72,88.6 43.35,117.22 55.79,117.22 56.42,117.85 81.66,117.85 85.66,121.85 86.37,121.85 ICSP.2
  Bottom 0.203: v11.61,59.35 11.61,60.68 C15.1 | v23.88,25.3 23.88,25.03 24.59,24.32 U12.29
RXI  (via drill 0.35)
  Top 0.203: v14.81,32.15 12.5,34.46 12.5,34.99 12.41,35.08 12.41,36.86 12.77,37.21 12.77,41.66 2.9,51.53 2.9,59.7 2.54,60.06 2.54,61.22 4.5,63.17 4.76,63.17 10.9,69.31 10.9,77.93 11.97,79 11.97,96.51 11.52,96.95 11.52,97.67 FTDI.3
  Bottom 0.203: v14.81,32.15 18.01,32.15 24.59,25.57 24.59,25.39 25.03,24.94 U12.30
SCK  (via drill 0.35)
  Top 0.203: v70.91,10.9 81.04,10.9 82.82,12.68 87.09,12.68 117.4,42.99 117.4,77.66 117.05,78.02 117.05,91.89 88.77,120.16 88.77,120.87 ICSP.4
  Bottom 0.203: U12.17 26.72,16.14 26.81,16.23 27.08,16.23 28.68,14.63 36.95,14.63 41.04,10.54 41.92,10.54 45.66,6.81 64.77,6.81 68.59,10.63 69.75,10.63 R24.1 69.84,10.63 70.11,10.9 v70.91,10.9
SCL  (via drill 0.35)
  Top 0.203: v109.13,23.08 107.71,23.08 v107.44,23.34 | v27.52,21.48 30.9,18.1 32.5,18.1 v39.88,10.72
  Bottom 0.203: v109.13,23.08 109.31,22.9 109.31,22.1 R19.1 109.22,22.01 109.22,21.57 108.78,21.12 108.33,21.12 97.22,10.01 84.33,10.01 80.77,6.45 45.48,6.45 42.1,9.83 41.21,9.83 40.32,10.72 v39.88,10.72 | v107.44,23.34 107.18,23.61 107.18,24.5 U10.5 | v27.52,21.48 26.28,21.48 24.06,23.7 U12.28
SDA  (via drill 0.35)
  Top 0.203: v29.21,20.77 29.66,20.77 31.97,18.46 32.68,18.46 38.46,12.68 43.35,12.68 45.84,10.19 83.44,10.19 85.66,7.96 86.37,7.96 86.82,8.41 88.69,8.41 v104.07,23.79
  Bottom 0.203: 105.4,23.79 105.4,25.3 105.67,25.57 107.89,25.57 108.16,25.3 108.16,24.59 U10.4 | 105.4,23.79 105.4,23.08 105.49,22.99 105.49,22.1 R20.1 | v29.21,20.77 26.01,20.77 23.7,23.08 23.52,23.08 U12.27 | 105.4,23.79 v104.07,23.79
TXO
  Bottom 0.203: U12.31 25.57,25.57 18.28,32.86 14.54,32.86 6.01,41.39 6.01,48.15 2.99,51.17 2.99,62.73 3.34,63.08 3.34,64.33 5.12,66.11 5.12,86.64 10.19,91.71 10.19,94.29 10.1,94.38 10.1,95.53 FTDI.2
VCC  (via drill 0.35)
  Top 0.254: v3.7,59.35 3.52,59.53 3.52,60.59 LED1.A
  Bottom 0.254: 70.82,123.09 70.91,123 70.91,122.38 R17.2 | 70.82,123.09 70.55,123.36 66.19,123.36 65.84,123 65.84,122.38 C9.1 65.75,122.38 64.77,122.38 59.62,117.22 38.81,117.22 33.39,111.8 33.3,111.89 | 70.82,123.09 71,123.27 86.46,123.27 86.55,123.18 86.64,123.18 86.73,123.09 86.82,123.09 86.91,123 87.09,123 87.17,122.91 87.35,122.91 87.53,122.73 88.42,122.73 88.95,123.27 89.66,123.27 ICSP.3 89.75,123.18 89.75,123 90.64,122.11 90.64,121.76 91.09,121.31 91.26,121.31 91.35,121.22 91.53,121.22 91.62,121.13 91.71,121.13 91.8,121.05 91.89,121.05 91.98,120.96 92.15,120.96 103.8,109.31 103.8,108.33 103.35,107.89 C8.1 103.44,107.8 103.71,107.8 105.31,106.2 R15.2 105.22,106.11 105.22,105.84 104.95,105.58 104.95,105.31 122.73,87.53 122.73,73.66 122.38,73.31 121.93,73.31 C7.1 121.85,73.22 121.85,71.62 122.38,71.08 122.38,70.91 122.29,70.82 R13.2 | 84.33,10.63 82.46,8.76 79.88,8.76 79.44,9.21 79.44,9.48 R9.2 79.35,9.48 78.55,9.48 76.42,11.61 68.95,11.61 67.71,10.37 65.22,10.37 C12.2 65.13,10.28 65.13,9.83 62.55,7.25 46.9,7.25 44.68,9.48 44.68,10.9 44.59,10.99 | 84.33,10.63 84.33,10.9 84.24,10.99 84.24,11.25 C5.1 | C6.1 113.76,34.9 113.76,34.72 113.67,34.63 113.67,34.37 112.51,33.21 112.51,32.86 R11.2 112.42,33.03 111.62,33.03 108.07,29.48 108.07,27.26 U10.3 108.07,27.08 108.07,26.1 108.87,25.3 108.87,23.79 107.53,22.46 107.53,22.1 R19.2 107.53,22.01 107.27,21.74 106.82,21.74 106.11,21.03 104.24,21.03 104.07,21.21 | 104.07,21.21 103.8,21.48 103.8,22.01 R20.2 | 104.07,21.21 93.31,10.45 84.51,10.45 84.33,10.63 | 33.3,111.89 30.19,108.78 29.66,108.78 29.03,109.4 C1.1 28.86,109.4 28.68,109.4 28.23,108.96 23.26,108.96 14.63,100.33 14.1,100.33 13.65,99.89 12.94,99.89 FTDI.4 12.85,99.8 12.85,99 12.77,98.91 12.77,98.64 12.94,98.47 12.94,81.93 10.37,79.35 10.1,79.35 10.01,79.44 9.92,79.44 R3.2 9.74,79.44 9.92,79.26 9.92,79.17 9.3,78.55 9.3,77.04 C2.1 9.21,77.04 8.5,77.04 5.56,74.11 5.56,65.93 3.79,64.15 3.79,59.44 v3.7,59.35 4.5,58.55 4.5,58.19 C13.A 4.59,58.02 4.59,57.57 5.92,56.24 5.92,55.7 7.43,54.19
  Bottom 0.254: 33.3,111.89 33.3,111.98 32.95,112.33 32.95,112.6 R1.2 | 44.59,10.99 41.84,10.99 40.15,12.68 40.15,12.94 40.24,13.03 40.24,13.39 R7.2 40.15,13.48 33.66,19.97 33.66,20.32 32.59,21.39 32.5,21.39 32.41,21.48 32.06,21.48 31.97,21.39 30.55,21.39 | 44.59,10.99 45.04,11.43 45.04,11.7 C4.1 | 30.55,22.72 30.55,21.39 | 30.55,21.39 30.55,21.03 26.19,16.68 U12.18 | 30.55,22.72 31.35,23.52 U12.6 | 29.3,23.79 29.75,24.23 29.75,24.32 30.01,24.59 U12.4 | 29.3,23.79 29.3,23.7 30.19,22.81 30.46,22.81 30.55,22.72 | 10.1,55.17 13.57,51.7 13.57,50.19 C11.1 | 10.1,55.17 10.1,55.97 10.01,56.06 9.83,56.06 U11.5 | 7.43,54.19 8.32,55.08 10.01,55.08 10.1,55.17 | 7.43,54.19 5.39,52.15 5.39,49.39 5.92,48.86 6.99,48.86 14.19,41.66 14.19,41.12 13.65,40.59 13.65,40.5 R5.2 13.57,40.41 13.57,39.97 14.9,38.64 14.9,38.46 14.81,38.37 C3.1 14.99,38.37 15.08,38.37 15.25,38.55 15.61,38.55 16.5,37.66 16.5,36.95 27.35,26.1 27.35,25.74 27.26,25.66 27.26,24.68 28.06,23.88 29.21,23.88 29.3,23.79
  pour Top: 0.45,128.72 137.61,129.99 119.83,129.99
VOUT
  Bottom 0.203: U10.1 106.2,27.17 106.2,31.79 125.31,50.9 125.31,53.39 127,55.08 127.18,55.08 OUTPUT.2

### Text on the board
tNames: G | V
bNames: + | - | -